# Altium schematic sheet Frontend.SchDoc: Frontend - Top Level
size A4; Date: 21.09.2023; ApprovedBy: Prof. Dr. Jens Anders; Author: M.Sc. Tobias Wirth; CompanyName: IIS; DrawnBy: M.Sc. Tobias Wirth; Engineer: M.Sc. Tobias Wirth; Organization: University of Stuttgart; Address1: Pfaffenwaldring 47; Address2: 70569 Stuttgart; Revision: V1.1; SheetNumber: 1; SheetTotal: 2; Project: Austrailia - NMR System; ENG_APP_DATE: --/--/--; DSN_APP_DATE: --/--/--; CHK_APP_DATE: --/--/--; ProjectNameAlt: AUS - NRM System; Time: 15:00
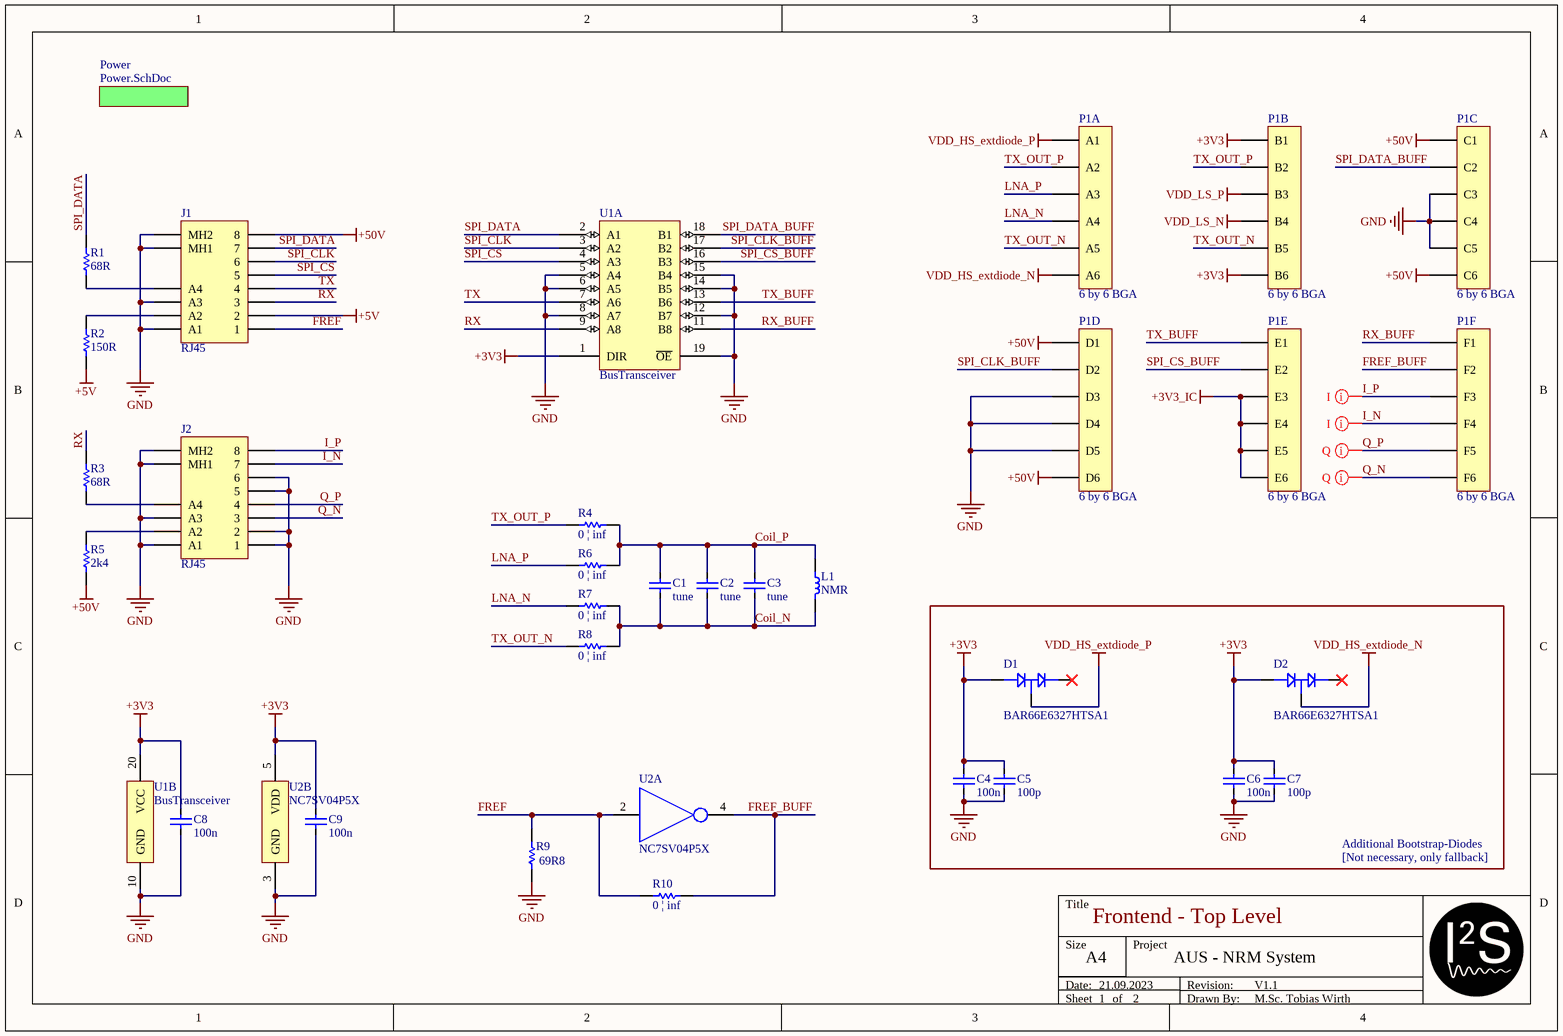
[diagram p0: Frontend.SchDoc]

## Parts
C1  tune  [CAP_1206]
C2  tune  [CAP_0805]
C3  tune  [CAP_0603]
C4  100n  [CAP_0603]
C5  100p  [CAP_0603]
C6  100n  [CAP_0603]
C7  100p  [CAP_0603]
C8  100n  [CAP_0603]
C9  100n  [CAP_0603]
D1  BAR66E6327HTSA1  [SOT23]
D2  BAR66E6327HTSA1  [SOT23]
J1  RJ45  [RJ45 - RJE3A1880412]
J2  RJ45  [RJ45 - RJE3A1880412]
L1  NMR  [NMR-Coil-Pads]
P1  6 by 6 BGA  [BGA36C230P6X6_1500X1500X190 - Interposer]  (parts A,B,C,D,E,F of 6)
R1  68R  [RES_0603]
R2  150R  [RES_0603]
R3  68R  [RES_0603]
R4  value 0 | inf  [RES_0603]
R5  2k4  [RES_0603]
R6  value 0 | inf  [RES_0603]
R7  value 0 | inf  [RES_0603]
R8  value 0 | inf  [RES_0603]
R9  value 69R8  [RES_0603]
R10  value 0 | inf  [RES_0603]
U1  BusTransceiver  [TSSOP-20]  (parts A,B of 2)
U2  NC7SV04P5X  [SOT23-65P210X110-5N]  (parts A,B of 2)

## Sub-sheets
Power = Power.SchDoc: no entries

## Nets
+3V3: C4.1 C5.1 C6.1 C7.1 C8.1 C9.1 D1.1 D2.1 P1.B1 P1.B6 U1.1(DIR) U1.20(VCC) U2.5(VDD)
+3V3_IC: P1.E3 P1.E4 P1.E5 P1.E6
+5V: J1.2 R2.2
+50V: J1.8 P1.C1 P1.C6 P1.D1 P1.D6 R5.2
GND: C4.2 C5.2 C6.2 C7.2 C8.2 C9.2 J1.A1 J1.A3 J1.MH1 J1.MH2 J2.1 J2.2 J2.5 J2.6 J2.A1 J2.A3 J2.MH1 J2.MH2 P1.C3 P1.C4 P1.C5 P1.D3 P1.D4 P1.D5 R9.1 U1.5(A4) U1.6(A5) U1.8(A7) U1.10(GND) U1.12(B7) U1.14(B5) U1.15(B4) U1.19(~{OE}) U2.3(GND)
VDD_HS_extdiode_N: D2.3 P1.A6
VDD_HS_extdiode_P: D1.3 P1.A1
VDD_LS_N: P1.B4
VDD_LS_P: P1.B3
Coil_N: C1.2 C2.2 C3.2 L1.2 R7.1 R8.1
Coil_P: C1.1 C2.1 C3.1 L1.1 R4.1 R6.1
FREF: J1.1 R9.2 R10.2 U2.2
FREF_BUFF: P1.F2 R10.1 U2.4
I_N: J2.7 P1.F4
I_P: J2.8 P1.F3
LNA_N: P1.A4 R7.2
LNA_P: P1.A3 R6.2
Q_N: J2.3 P1.F6
Q_P: J2.4 P1.F5
RX: J1.3 R3.1 U1.9(A8)
RX_BUFF: P1.F1 U1.11(B8)
SPI_CLK: J1.6 U1.3(A2)
SPI_CLK_BUFF: P1.D2 U1.17(B2)
SPI_CS: J1.5 U1.4(A3)
SPI_CS_BUFF: P1.E2 U1.16(B3)
SPI_DATA: J1.7 R1.1 U1.2(A1)
SPI_DATA_BUFF: P1.C2 U1.18(B1)
TX: J1.4 U1.7(A6)
TX_BUFF: P1.E1 U1.13(B6)
TX_OUT_N: P1.A5 P1.B5 R8.2
TX_OUT_P: P1.A2 P1.B2 R4.2
NetJ1_A2: J1.A2 R2.1
NetJ1_A4: J1.A4 R1.2
NetJ2_A2: J2.A2 R5.1
NetJ2_A4: J2.A4 R3.2

Not connected (* = marked no-connect by the designer): D1 2*; D2 2*

## Layout directives
differential pair; differential pair class IQ; net class IQ: I_N, I_P, Q_N, Q_P

## Notes on the sheet
- Additional Bootstrap-Diodes
  [Not necessary, only fallback]
- Title
- Size
- Date:
- Sheet
- A4
- of
- Project
- Drawn By:
- Revision:

## Library data of the parts
C1-C9 = Cap: Supplier: *; Part Number: *
  C1-C3: Value: tune
  C4 C6 C8 C9: Value: 100n
  C5 C7: Value: 100p
D1 D2 = Diode_series: SMP1320-075LF (SC-70) / BAV99 (SOT23)
J1 J2 = RJ45: Ethernet Connectors RJ45 SMT
L1 = Ind: Part Number: *; Supplier: *; Value: NMR
P1 = BGA_6x6
R1-R10 = Res: Part Number: *; Supplier: *
  R1 R3: Value: 68R
  R2: Value: 150R
  R5: Value: 2k4
U1 = 74LVC245A